# Altium schematic sheet USB-ESP32.SchDoc
size B
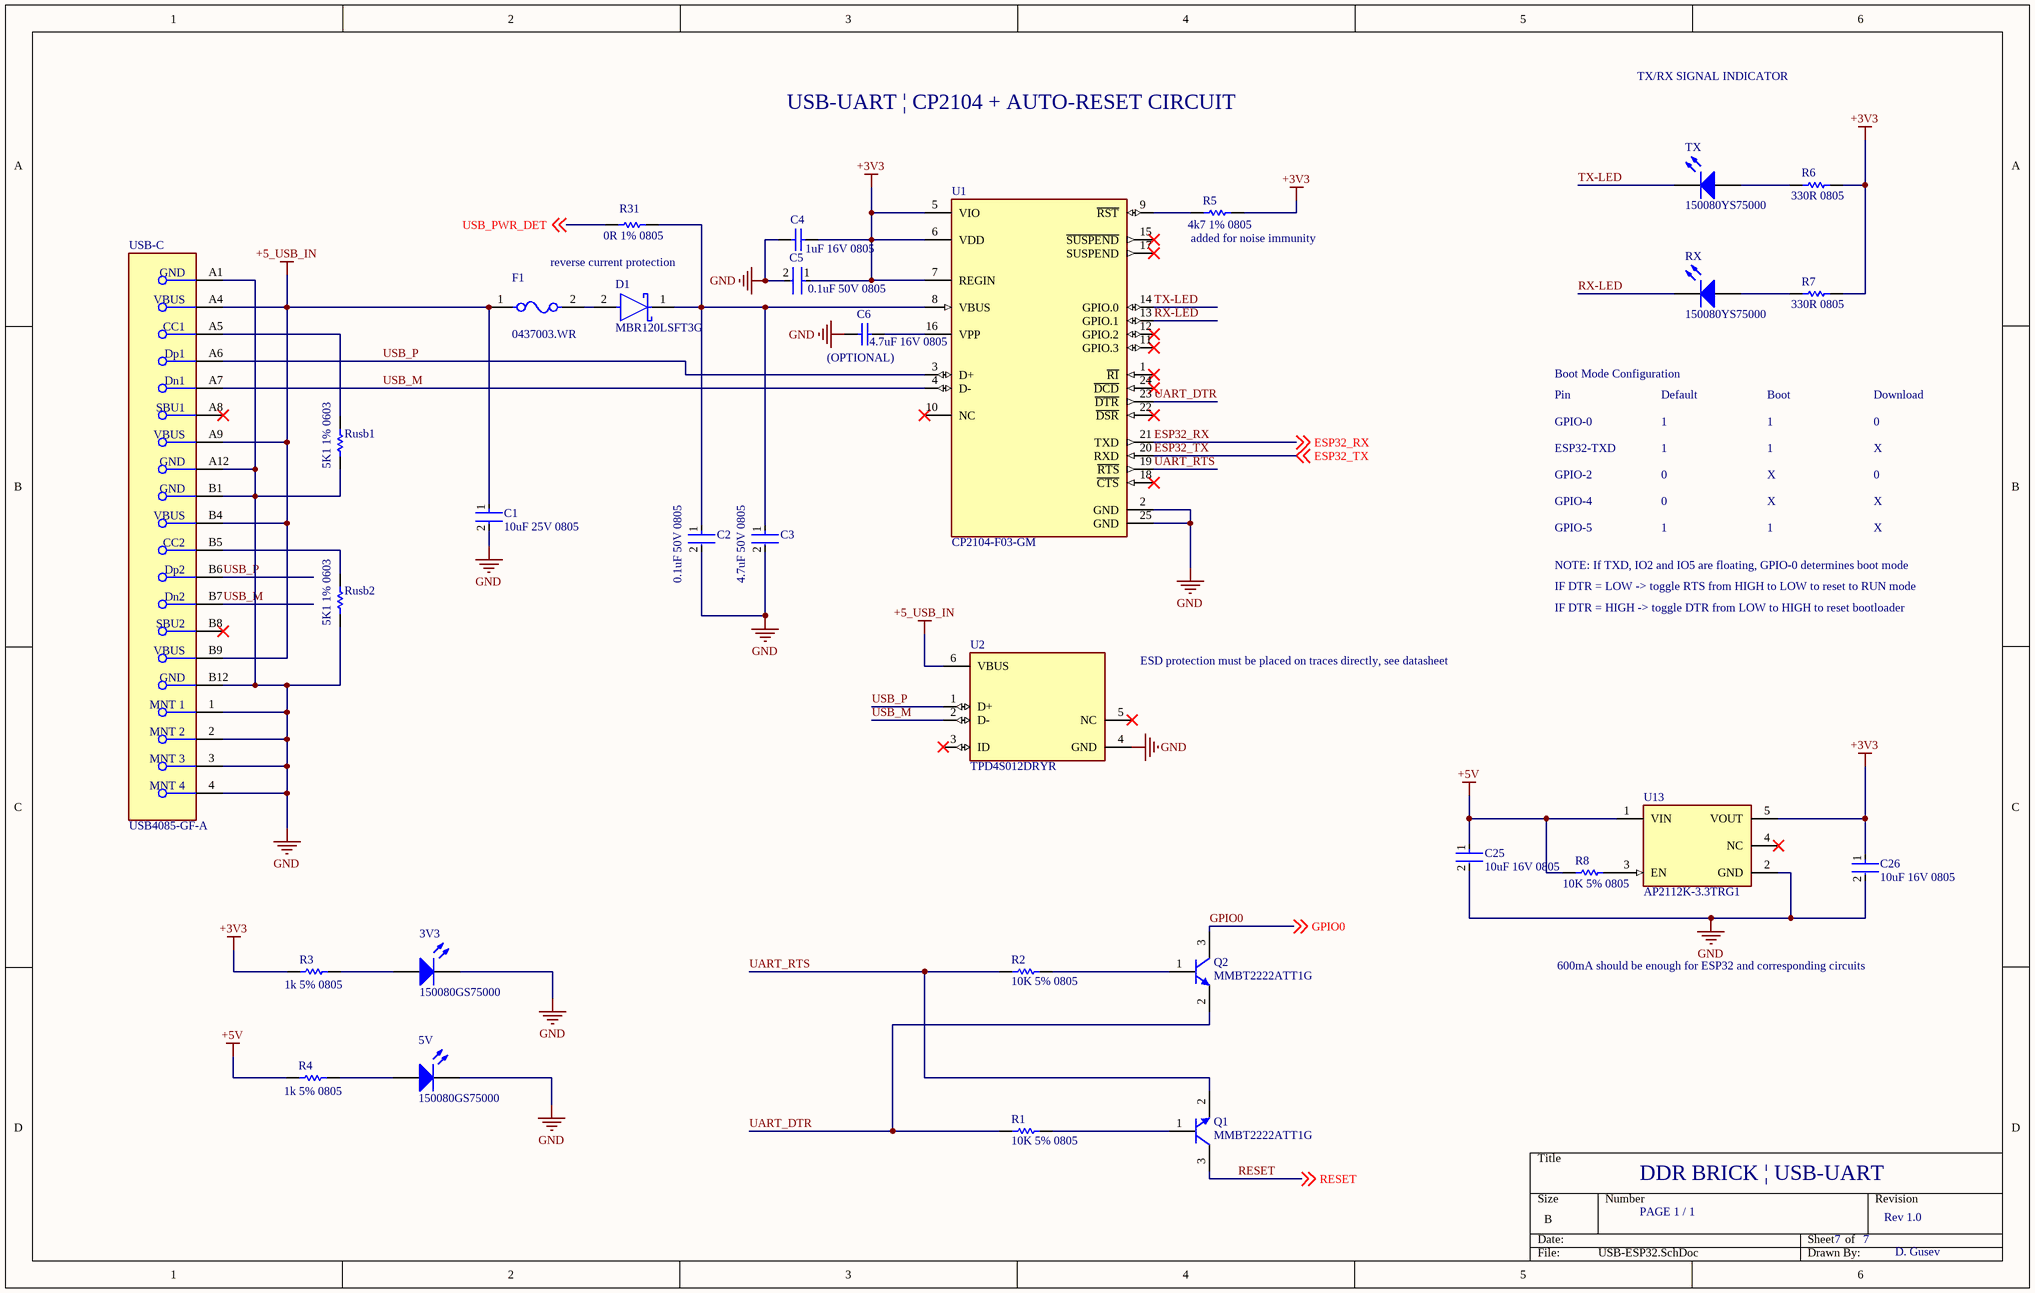
[diagram p0: USB-ESP32.SchDoc]

## Parts
3V3  150080GS75000  [0805_A]
5V  150080GS75000  [0805_A]
C1  10uF 25V 0805  [FP-GRM21B-0_15-IPC_C]
C2  0.1uF 50V 0805  [FP-C0805C-DN-MFG]
C3  4.7uF 50V 0805  [FP-C2012-125-MFG]
C4  1uF 16V 0805  [CAPC2013X145X50LL20T25]
C5  0.1uF 50V 0805  [FP-C0805C-DN-MFG]
C6  4.7uF 16V 0805  [CAPC2013X140X50LL20T25]
C25  10uF 16V 0805  [FP-GRM21B-0_1-IPC_C]
C26  10uF 16V 0805  [FP-GRM21B-0_1-IPC_C]
D1  MBR120LSFT3G  [FP-498-MFG]
F1  0437003.WR  [FP-437-MFG]
Q1  MMBT2222ATT1G  [ONSC-SC-75-3-463-01_V]
Q2  MMBT2222ATT1G  [ONSC-SC-75-3-463-01_V]
R1  10K 5% 0805  [RESC2013X60X40ML20T25]
R2  10K 5% 0805  [RESC2013X60X40ML20T25]
R3  1k 5% 0805  [RESC2013X60X35ML10T20]
R4  1k 5% 0805  [RESC2013X60X35ML10T20]
R5  4k7 1% 0805  [YAGO-RC0805_M]
R6  330R 0805  [RESC2013X60X35LL10T20]
R7  330R 0805  [RESC2013X60X35LL10T20]
R8  10K 5% 0805  [RESC2013X60X40ML20T25]
R31  0R 1% 0805  [RESC2013X60X35ML10T20]
Rusb1  5K1 1% 0603  [RESC1608X55X25ML10T15]
Rusb2  5K1 1% 0603  [RESC1608X55X25ML10T15]
RX  150080YS75000  [0805_A]
TX  150080YS75000  [0805_A]
U1  CP2104-F03-GM  [FP-CP2104-F03-GM-MFG]
U2  TPD4S012DRYR  [FP-DRY0006A-MFG]
U13  AP2112K-3.3TRG1  [FP-SOT25-IPC_A]
USB-C  USB4085-GF-A  [FP-USB4085-GF-A-MFG]

## Nets
+3V3: C4.2 C5.1 C26.1 R3.1 R5.2 R6.2 R7.2 U1.5(VIO) U1.6(VDD) U1.7(REGIN) U13.5(VOUT)
+5_USB_IN: C1.1 F1.1 U2.6(VBUS) USB-C.A4(VBUS) USB-C.A9(VBUS) USB-C.B4(VBUS) USB-C.B9(VBUS)
+5V: C25.1 R4.1 R8.2 U13.1(VIN)
GND: 3V3.1(K) 5V.1(K) C1.2 C2.2 C3.2 C4.1 C5.2 C6.2 C25.2 C26.2 Rusb1.1 Rusb2.1 U1.2(GND) U1.25(GND) U2.4(GND) U13.2(GND) USB-C.1(MNT_1) USB-C.2(MNT_2) USB-C.3(MNT_3) USB-C.4(MNT_4) USB-C.A1(GND) USB-C.A12(GND) USB-C.B1(GND) USB-C.B12(GND)
ESP32_RX: U1.21(TXD) ; off-sheet ESP32_RX
ESP32_TX: U1.20(RXD) ; off-sheet ESP32_TX
GPIO0: Q2.3(C) ; off-sheet GPIO0
RESET: Q1.3(C) ; off-sheet RESET
RX-LED: RX.1(K) U1.13(GPIO.1)
TX-LED: TX.1(K) U1.14(GPIO.0)
UART_DTR: Q2.2(E) R1.2 U1.23(~{DTR})
UART_RTS: Q1.2(E) R2.2 U1.19(~{RTS})
USB_M: U1.4(D-) U2.2(D-) USB-C.A7(Dn1) USB-C.B7(Dn2)
USB_P: U1.3(D+) U2.1(D+) USB-C.A6(Dp1) USB-C.B6(Dp2)
USB_PWR_DET: R31.1 ; off-sheet USB_PWR_DET
Net3V3_2: 3V3.2(A) R3.2
Net5V_2: 5V.2(A) R4.2
NetC2_1: C2.1 C3.1 D1.1(C) R31.2 U1.8(VBUS)
NetC6_1: C6.1 U1.16(VPP)
NetD1_2: D1.2(A) F1.2
NetQ1_1: Q1.1(B) R1.1
NetQ2_1: Q2.1(B) R2.1
NetR5_1: R5.1 U1.9(~{RST})
NetR6_1: R6.1 TX.2(A)
NetR7_1: R7.1 RX.2(A)
NetR8_1: R8.1 U13.3(EN)
NetRusb1_2: Rusb1.2 USB-C.A5(CC1)
NetRusb2_2: Rusb2.2 USB-C.B5(CC2)

Not connected (* = marked no-connect by the designer): U1 1(~{RI})* 10(NC)* 11(GPIO.3)* 12(GPIO.2)* 15(~{SUSPEND})* 17(SUSPEND)* 18(~{CTS})* 22(~{DSR})* 24(~{DCD})*; U2 3(ID)* 5(NC)*; U13 4(NC)*; USB-C A8(SBU1)* B8(SBU2)*

## Notes on the sheet
- TX/RX SIGNAL INDICATOR
- USB-UART | CP2104 + AUTO-RESET CIRCUIT
- reverse current protection
- (near R5) added for noise immunity
- (near C6) (OPTIONAL)
- Boot Mode Configuration
- Pin
- GPIO-0
- Default
- 1
- Boot
- Download
- 0
- ESP32-TXD
- GPIO-2
- GPIO-4
- X
- GPIO-5
- NOTE: If TXD, IO2 and IO5 are floating, GPIO-0 determines boot mode
- IF DTR = LOW -> toggle RTS from HIGH to LOW to reset to RUN mode
- IF DTR = HIGH -> toggle DTR from LOW to HIGH to reset bootloader
- (near U2) ESD protection must be placed on traces directly, see datasheet
- 600mA should be enough for ESP32 and corresponding circuits
- DDR BRICK | USB-UART
- PAGE 1 / 1
- 7
- Rev 1.0
- D. Gusev

## Library data of the parts
3V3 5V = CMP-1426-00007-1: SMD mono-color Chip LED, WL-SMCW, Green; Manufacturer: Wuerth Elektronik; PackageReference: 0805_A; Color: Green; PartNumber: 150080GS75000; ComponentLink2URL: http://katalog.we-online.com/led/datasheet/150080GS75000.pdf; ComponentLink1URL: http://www.we-online.com; ComponentLink1Description: Manufacturer URL; ComponentLink2Description: Datasheet
C1 = CMP-2007-03541-2: Chip Multilayer Ceramic Capacitors for General Purpose, 0805, 10uF, X5R, 15%, 10%, 25V; Length: 2mm; Depth: 1.25mm; Termination: SMD/SMT; Voltage: 25V; Height: 1.25mm; Material: Ceramic; Thickness: 0.053inch; Radiation Hardening: No; Min Operating Temperature: -55°C; Width: 0.049inch; Package Quantity: 1; Mount: Surface Mount; Dielectric: X5R; Packaging: Tape and Reel; Capacitance: 10uF; Voltage Rating (DC): 25V; Lead Free: Lead Free; Max Operating Temperature: 85°C; Case Code (Imperial): 0805; Case/Package: 0805; Tolerance: 10%; Voltage Rating: 25V; Case Code (Metric): 2012
C2 C5 = CMP-2007-00279-2: CAP CER 0.1UF 50V X7R 0805; Manufacturer Part Number: C0805C104K5RACTU; Manufacturer: KEMET; Value: 0.10 μF; Tolerance: 0.1; Temperature Coefficient: 30ppm/°C; Material: Ceramic; Device Class L2: Capacitors; Temperature Range Low: -55°C; Voltage Rating: 50 V; Digikey Description: CAP CER 0.1UF 50V X7R 0805; Category: Cap; ComponentLink2Description: Datasheet; Octopart: https://octopart.com/c0805c104k5ractu-kemet-143926; RoHS: TRUE; ComponentLink2URL: https://content.kemet.com/datasheets/KEM_C1003_C0G_SMD.pdf; Temperature Characteristic: X7R; Temperature: -55°C to +125°C; Height: 0.88mm; Temperature Range High: +125°C; Device Class L1: Passive Components; Automotive: No; Lead Free: Yes; Ipc Land Pattern Name: CAPC200125X78; Device Class L3: Ceramic Capacitors; Mouser Description: Cap Ceramic 0.1uF 50V X7R 10% SMD 2.0 x 1.2 mm 125 C Paper T/R; Capacitance: 0.10 μF; Package: C0805C-DN
C3 = CMP-08246-000007-1: CAP CER 4.7UF 50V X5R 0805; Manufacturer Part Number: C2012X5R1H475K125AB; Manufacturer: TDK Corporation; Tolerance: 10%; Temperature Coefficient: 15%; Material: Ceramic; Mouser Description: Multilayer Ceramic Capacitors MLCC - SMD/SMT 0805 4.7uF 50volts X5R 10%; Category: Cap; Temperature Range High: +85°C; Digikey Description: CAP CER 4.7UF 50V X5R 0805; Voltage Rating: 50V; Device Class L1: Passive Components; Temperature Range Low: -55°C; Lead Free: Yes; ComponentLink2Description: Datasheet; Capacitance: 4.7uF; Octopart: https://octopart.com/c2012x5r1h475k125ab-tdk-25947720; Device Class L2: Capacitors; Value: 4.7uF; Temperature: -55°C to +85°C; ComponentLink2URL: https://product.tdk.com/info/en/catalog/datasheets/mlcc_commercial_general_en.pdf; RoHS: TRUE; Height: 1.45mm; Temperature Characteristic: X5R; Package: C2012-125; Device Class L3: Ceramic Capacitors; Automotive: No
C4 = CMP-1036-04746-2: Manufacturer: Kemet; Part Number: C0805C105K4PACTU
C6 = CMP-2007-03297-1: Part Number: C0805C475K4PACTU; Manufacturer: Kemet
C25 C26 = CMP-2007-03453-2: Chip Multilayer Ceramic Capacitors for General Purpose, 0805, 10uF, X5R, 15%, 10%, 16V; Radiation Hardening: No; Thickness: 0.053inch; Voltage Rating (DC): 16V; Lead Free: Lead Free; Package Quantity: 1; Width: 1.25mm; Case Code (Imperial): 0805; Depth: 1.25mm; Packaging: Tape and Reel; Dielectric: X5R; Max Operating Temperature: 85°C; Tolerance: 10%; Voltage Rating: 16V; Voltage: 16V; Capacitance: 10uF; Height: 1.25mm; Case Code (Metric): 2012; Material: Ceramic; Mount: Surface Mount; Case/Package: 0805; REACH SVHC: No SVHC; Length: 2mm; Min Operating Temperature: -55°C; Termination: SMD/SMT
D1 = CMP-1055-00451-2: DIODE SCHOTTKY 20V 1A SOD123L; Max Forward Surge Current (Ifsm): 50A; Polarity: Standard; Element Configuration: Single; Forward Voltage: 650mV; Max Reverse Current: 25mA; Max Reverse Leakage Current: 400uA; Height: 0.9mm; Radiation Hardening: No; Max Surge Current: 50A; Max Reverse Voltage (DC): 20V; Min Operating Temperature: -55°C; Length: 2.9mm; Output Current: 1A; Package Quantity: 10000; Halogen Free: Halogen Free; Packaging: Tape and Reel; Forward Current: 1A; Series: -; Current Rating: 1A; Voltage Rating (DC): 20V; Average Rectified Current: 1A; Peak Non-Repetitive Surge Current: 50A; Max Operating Temperature: 125°C; Mount: Surface Mount; Max Repetitive Reverse Voltage (Vrrm): 20V; Lead Free: Lead Free; Width: 1.8mm; Number of Pins: 2
F1 = CMP-08605-000049-1: FUSE BRD MNT 3A 32VAC 35VDC 1206; Manufacturer: Littelfuse Inc; Fuse Interrupt Ac Current: 50A; Value: 0.033Ω; Fuse Blow Speed: Fast; Voltage Rating: 32V; Max Fuse Dc Voltage: 35V; Fuse I2T: 0.506A2Sec; Fuse Voltage Drop: 0.14V; Octopart: https://octopart.com/0437003.wr-littelfuse-8600121; Category: Fuse; Fuse Interrupt Dc Current: 50A; Temperature: -55°C to +150°C; Device Class L1: Circuit Protection; Fuse Current: 3A; Temperature Range High: +150°C; Temperature Range Low: -55°C; Resistance: 0.033Ω; Automotive: No; ComponentLink2URL: https://www.littelfuse.com/~/media/electronics/datasheets/fuses/littelfuse_fuse_437_datasheet.pdf.pdf; Manufacturer Part Number: 0437003.WR; Ipc Land Pattern Name: CAPC320163X82; Mouser Description: Surface Mount Fuses 32V FA 1206 3A; Device Class L2: Fuses; Device Class L3: unset; Package: 437; RoHS: TRUE; Height: 0.8639mm; Digikey Description: FUSE BRD MNT 3A 32VAC 35VDC 1206; ComponentLink2Description: Datasheet; Lead Free: Yes; Max Fuse Ac Voltage: 32V
Q1 Q2 = CMP-1048-00417-1: General Purpose Transistor, NPN Silicon, 3-Pin SC-75, Pb-Free, Tape and Reel; Manufacturer: On Semiconductor; IC Continuous (A): 0.6; fT Min (MHz): 300; DatasheetVersion: Rev. 5; PackageVersion: Rev. F, 07/2005; ComponentLink1Description: Manufacturer URL; RoHS: TRUE; Packing: Tape and Reel; ComponentLink3URL: http://www.onsemi.com/pub_link/Collateral/463-01.PDF; ComponentLink1URL: http://www.onsemi.com/; ComponentLink3Description: Package Specification; ComponentLink2URL: http://www.onsemi.cn/pub_link/Collateral/MMBT2222ATT1-D.PDF; Mounting Technology: Surface Mount; PartNumber: MMBT2222ATT1G; ComponentLink2Description: Datasheet; Polarity: NPN; PackageReference: SC-75-3-463-01; PackageDescription: 3-Pin Small Outline Transistor, Body 1.6 x 0.8 mm, Pitch 0.5 mm
R1 R2 R8 = CMP-2001-00590-1: Part Number: ERA6AEB123V; Manufacturer: Panasonic
R3 R4 = CMP-2100-03671-1: Chip Resistor, 1 KOhm, +/- 1%, 125 mW, -55 to 155 degC, 0805 (2012 Metric), RoHS, Tape and Reel; Manufacturer: Yageo; Temperature Coefficient: 100ppm/degreesC; Voltage Rating (DC): 150V; Max Power Dissipation: 125mW; Resistance: 1KOhm; Number of Pins: 2; Number of Terminations: 2; Datasheet URL: http://www.yageo.com/NewPortal/yageodocoutput?fileName=/pdf/R-Chip/PYu-RC_Group_51_RoHS_L_5.pdf; Length: 0.079inch; Package Description: 2-Pin Surface Mounted Device, Body 2 x 1.25 mm; Depth: 1.25mm; Height: 0.024inch; Military Standard: Not; Case/Package: 0805; Package Reference: 0805; RoHSCompliant: true; Lead Free: LeadFree; Packaging: TapeandReel; Package Quantity: 1; Datasheet Version: Rev. 5, 10/2016; Tolerance: 1%; Min Operating Temperature: -55degC; Voltage Rating: 150V; Composition: ThickFilm; Case Code (Imperial): 0805; Power Rating: 125mW; Width: 0.049inch; Case Code (Metric): 2012; Manufacturer URL: http://www.yageo.com/; Max Operating Temperature: 155degC; REACH SVHC: Unknown; Termination: SMD/SMT
R5 = CMP-1568-00001-1: General Puprose Chip Resistor, 4700 Ohm +/- 1%, 0.125 W, -55 to 155 degC, 2-Pin SMD, RoHS, Tape and Reel; PartNumber: RC0805FR-074K7L; Tolerance: +/- 1%; Power: 0.125 W; PackageDescription: 2-Pin Surface Mount Device, Body 2 x 1.25 mm; ComponentLink2URL: http://www.yageo.com/documents/recent/PYu-RC_Group_51_RoHS_L-3.pdf; Temperature Min: -55 degC; Packing: Tape and Reel; Mounting Technology: Surface Mount; ComponentLink1URL: http://www.yageo.com/NewPortal/_en/index.jsp; Resistance: 4700 Ohm; Temperature Max: 155 degC; ComponentLink2Description: Datasheet; DatasheetVersion: Rev. 3; RoHS: TRUE; ComponentLink1Description: Manufacturer URL
R6 R7 = CMP-2000-06960-1: Chip Resistor, 330 Ohm, +/- 1%, 125 mW, -55 to 155 degC, 0805 (2012 Metric), RoHS, Tape and Reel; Manufacturer: Yageo; Voltage Rating: 150V; Temperature Coefficient: 100PPM/C; Power Rating: 125mW(1/8W); Resistance: 330Ohms; Datasheet Version: Rev. 7, 05/2017; Termination Style: SMD/SMT; Case Code - mm: 2012; Package Description: 2-Pin Surface Mounted Device, Body 2 x 1.25 mm; Operating Temperature Range: -55Cto+155C; Case Code - in: 0805; Packaging: Reel; Tolerance: 1%; Package Reference: 0805; Mounting Technology: SurfaceMount; Product: ThickFilmResistorsGeneralPurpose; Series: RC; Manufacturer URL: http://www.yageo.com/; Datasheet URL: http://www.yageo.com/documents/recent/PYu-RC_Group_51_RoHS_L_7.pdf
R31 = CMP-2100-03673-1: Chip Resistor, 0 Ohm, Jumper, +/- 5%, 0.125 W, -55 to 155 degC, 0805 (2012 Metric), RoHS, Tape and Reel; Manufacturer: Yageo; Power Rating: 125mW; Resistance: 0mOhm; Voltage Rating (DC): 150V; Temperature Coefficient: 200ppm/degreesC; Height: 0.5mm; Depth: 1.25mm; Case Code (Imperial): 0805; Lead Free: LeadFree; Military Standard: Not; Package Description: 2-Pin Surface Mounted Device, Body 2 x 1.25 mm; Case Code (Metric): 2012; Composition: ThickFilm; Voltage Rating: 150V; Manufacturer URL: http://www.yageo.com/; Packaging: TapeandReel; Package Reference: 0805; REACH SVHC: Unknown; Tolerance: 5%; Case/Package: 0805; Max Operating Temperature: 155degC; Number of Pins: 2; Min Operating Temperature: -55degC; RoHSCompliant: true; Length: 2mm; Datasheet URL: http://www.yageo.com/NewPortal/yageodocoutput?fileName=/pdf/R-Chip/PYu-RC_Group_51_RoHS_L_5.pdf; Termination: SMD/SMT; Radiation Hardening: No; Width: 1.25mm; Contact Plating: Tin; Datasheet Version: Rev. 5, 10/2016
Rusb1 Rusb2 = CMP-2000-04091-1: Manufacturer: Yageo; Part Number: RC0603FR-075K1L
RX TX = CMP-1426-00012-1: SMD mono-color Chip LED, WL-SMCW, Yellow; Manufacturer: Wuerth Elektronik; Color: Yellow; ComponentLink1URL: http://www.we-online.com; PackageReference: 0805_A; ComponentLink2URL: http://katalog.we-online.com/led/datasheet/150080YS75000.pdf; ComponentLink1Description: Manufacturer URL; ComponentLink2Description: Datasheet; PartNumber: 150080YS75000
U1 = CMP-0511-00004-2: IC SGL USB-TO-UART BRIDGE 24QFN; Number of Transceivers: 1; Max Supply Voltage: 3.6V; Operating Supply Current: 17mA; Operating Supply Voltage: 3.3V; Data Rate: 2Mbps; Min Supply Voltage: 3V; Number of Channels: 1; Max Operating Temperature: 85°C; Contact Plating: Tin; Min Operating Temperature: -40°C; Number of Pins: 24; Case/Package: QFN; Packaging: Rail/Tube; Radiation Hardening: No; Weight: 0.001764oz
U2 = CMP-0326-00038-4: TVS DIODE 5.5V 6SON; Breakdown Voltage: 24V; Interface: USB; ESD Protection: Yes; Peak Pulse Power: 60W; Number of Circuits: 4; Polarity: Unidirectional; Capacitance: 15pF; Test Current: 1mA; Working Voltage: 19V; Min Breakdown Voltage: 6V; Peak Pulse Current: 3A; Operating Supply Voltage: 950mV; Max Operating Temperature: 85°C; Packaging: Tape and Reel; Termination: SMD/SMT; Number of Pins: 6; Radiation Hardening: No; Width: 1.05mm; REACH SVHC: No SVHC; Lead Free: Lead Free; Depth: 1mm; Package Quantity: 5000; Length: 1.45mm; Direction: Unidirectional; Min Operating Temperature: -40°C; Number of Channels: 4; Max Power Dissipation: 60W; Height: 0.55mm
U13 = CMP-12756-000035-1: IC REG LINEAR 3.3V 600MA SOT25; Number of Regulators: 1; Output Type: Fixed; Polarity: Positive; Min Input Voltage: 2.5V; Max Input Voltage: 6V; Accuracy: 1.5%; Quiescent Current: 55uA; Dropout Voltage: 250mV; Min Operating Temperature: -40°C; Length: 3.1mm; Output Current: 600mA; Max Operating Temperature: 85°C; Package Quantity: 1; Output Voltage: 3.3V; Width: 1.7mm; Number of Outputs: 1; Packaging: Tape and Reel; Height: 1.3mm; Lead Free: Lead Free; Max Output Current: 600mA; Case/Package: SOT-23-5; Mount: Surface Mount; Number of Pins: 5
USB-C = CMP-196119-000001-1: CONN RCPT USB2.0 TYPEC 16POS; Manufacturer: Global Connector Technology; Voltage Rating: 20V; Conn Orientation: Right Angle; Shielding: true; Current Rating: 4.25A; Number Of Contacts: 16; Pitch: 0.85mm; Is Female: yes; ComponentLink2URL: https://gct.co/files/drawings/usb4085.pdf; Category: Conn; Automotive: No; ComponentLink2Description: Datasheet; Height: 3.66mm; Manufacturer Part Number: USB4085-GF-A; Package: 0; Usb Standard: USB 2.0; Octopart: https://octopart.com/usb4085-gf-a-global+connector+technology-94773699; Device Class L3: unset; Digikey Description: CONN RCPT USB2.0 TYPEC 16POS; Temperature Range Low: -40°C; Temperature: -40°C to +85°C; Lead Free: Yes; Contact Material: Gold,Nickel; Device Class L1: Connectors; Temperature Range High: +85°C; Device Class L2: USB Connectors; RoHS: TRUE